# EAGLE schematic 3x3 (EAGLE 7.2.0)
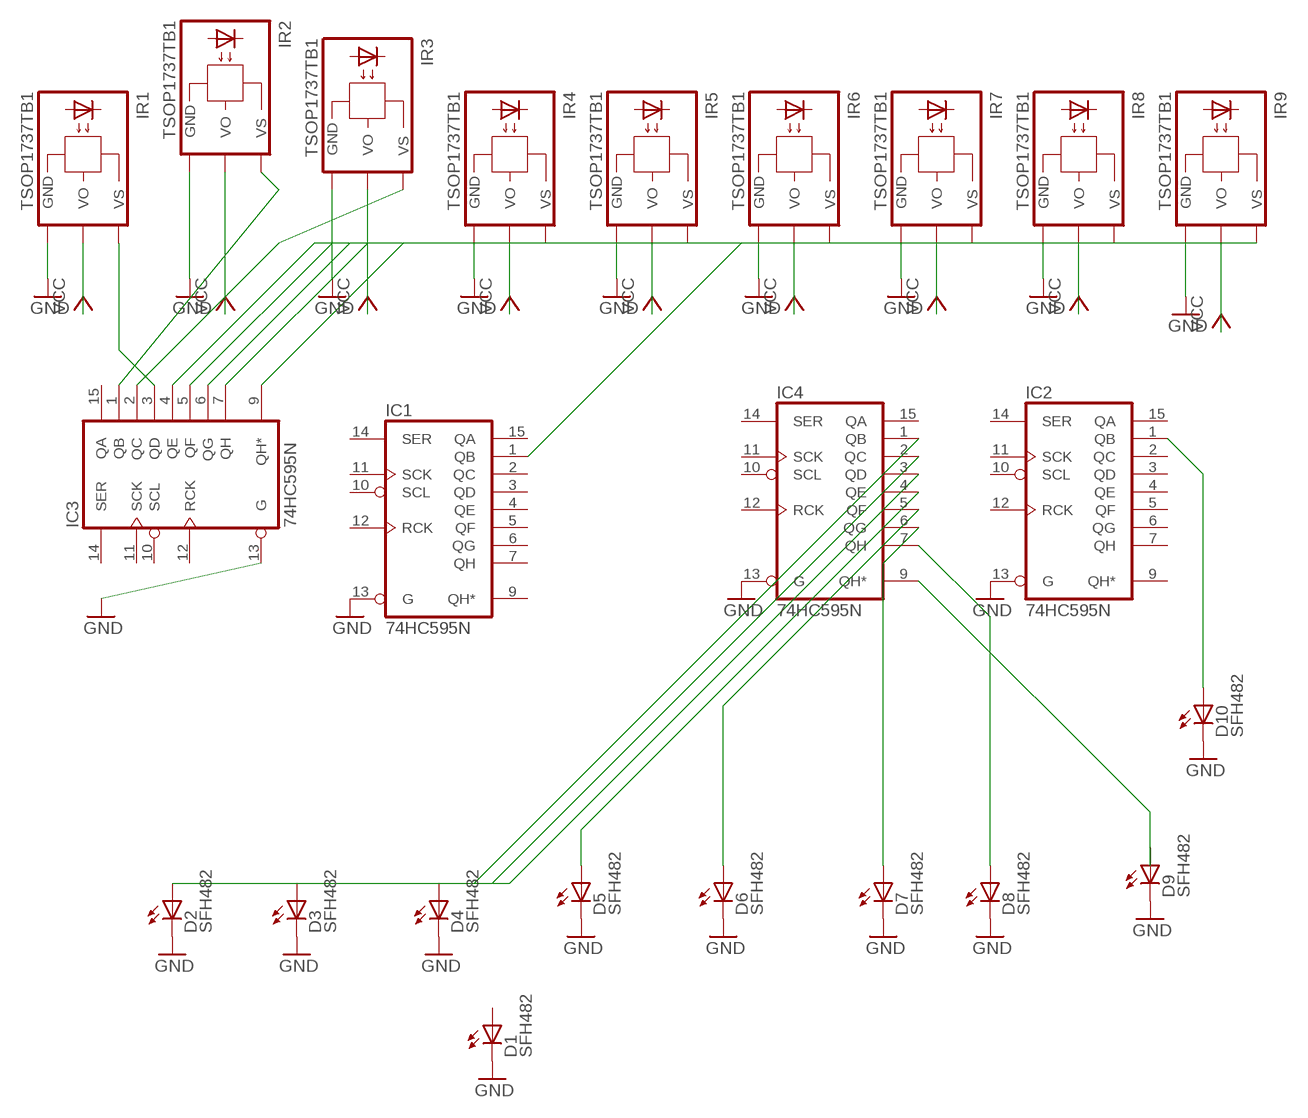
[diagram p0: schematic, sheet 1]

## Parts
D1  SFH482  [SFH482]
D2  SFH482  [SFH482]
D3  SFH482  [SFH482]
D4  SFH482  [SFH482]
D5  SFH482  [SFH482]
D6  SFH482  [SFH482]
D7  SFH482  [SFH482]
D8  SFH482  [SFH482]
D9  SFH482  [SFH482]
D10  SFH482  [SFH482]
IC1  74HC595N  [DIL16]
IC2  74HC595N  [DIL16]
IC3  74HC595N  [DIL16]
IC4  74HC595N  [DIL16]
IR1  TSOP1737TB1  [TSOP17_TB1]
IR2  TSOP1737TB1  [TSOP17_TB1]
IR3  TSOP1737TB1  [TSOP17_TB1]
IR4  TSOP1737TB1  [TSOP17_TB1]
IR5  TSOP1737TB1  [TSOP17_TB1]
IR6  TSOP1737TB1  [TSOP17_TB1]
IR7  TSOP1737TB1  [TSOP17_TB1]
IR8  TSOP1737TB1  [TSOP17_TB1]
IR9  TSOP1737TB1  [TSOP17_TB1]

## Nets
GND: D1.K(C) D2.K(C) D3.K(C) D4.K(C) D5.K(C) D6.K(C) D7.K(C) D8.K(C) D9.K(C) D10.K(C) IC1.13(G) IC2.13(G) IC3.13(G) IC4.13(G) IR1.GND IR2.GND IR3.GND IR4.GND IR5.GND IR6.GND IR7.GND IR8.GND IR9.GND
N$1: IC3.3(QD) IR1.VS
N$2: IC3.1(QB) IR2.VS
N$3: IC3.2(QC) IR3.VS
N$4: IC3.4(QE) IR4.VS
N$5: IC3.5(QF) IR5.VS
N$6: IC3.6(QG) IR6.VS
N$7: IC3.7(QH) IR7.VS
N$8: IC3.9(QH*) IR8.VS
N$9: IC1.1(QB) IR9.VS
N$10: D2.A IC4.1(QB) IC4.2(QC) IC4.3(QD)
N$11: D5.A IC4.4(QE)
N$12: D6.A IC4.5(QF)
N$13: D7.A IC4.6(QG)
N$14: D8.A IC4.7(QH)
N$15: IC4.9(QH*)
N$16: D10.A IC2.1(QB)
VCC: IR1.VO IR2.VO IR3.VO IR4.VO IR5.VO IR6.VO IR7.VO IR8.VO IR9.VO
Unconnected: D1.A D3.A D4.A D9.A IC1.2(QC) IC1.3(QD) IC1.4(QE) IC1.5(QF) IC1.6(QG) IC1.7(QH) IC1.9(QH*) IC1.10(SCL) IC1.11(SCK) IC1.12(RCK) IC1.14(SER) IC1.15(QA) IC2.2(QC) IC2.3(QD) IC2.4(QE) IC2.5(QF) IC2.6(QG) IC2.7(QH) IC2.9(QH*) IC2.10(SCL) IC2.11(SCK) IC2.12(RCK) IC2.14(SER) IC2.15(QA) IC3.10(SCL) IC3.11(SCK) IC3.12(RCK) IC3.14(SER) IC3.15(QA) IC4.10(SCL) IC4.11(SCK) IC4.12(RCK) IC4.14(SER) IC4.15(QA)

## Power pins joined to a net without a drawn wire
GND: IC1.8(GND) IC2.8(GND) IC3.8(GND) IC4.8(GND)
VCC: IC1.16(VCC) IC2.16(VCC) IC3.16(VCC) IC4.16(VCC)

## Library data of the parts
D1-D10 = led:SFH482: IR LED infrared emitting diode, Infineon
IC1-IC4 = 74xx-eu:74*595: 8-bit SHIFT REGISTER, output latch
IR1-IR9 = telefunken:TSOP17*TB1: TSOP17..TB1 IR Receiver Modules for Remote Control Systems Source: http://www.vishay.com/docs/82042/82042.pdf; OC_FARNELL: unknown; OC_NEWARK: unknown